# EAGLE design main_schematic (EAGLE 5.11)
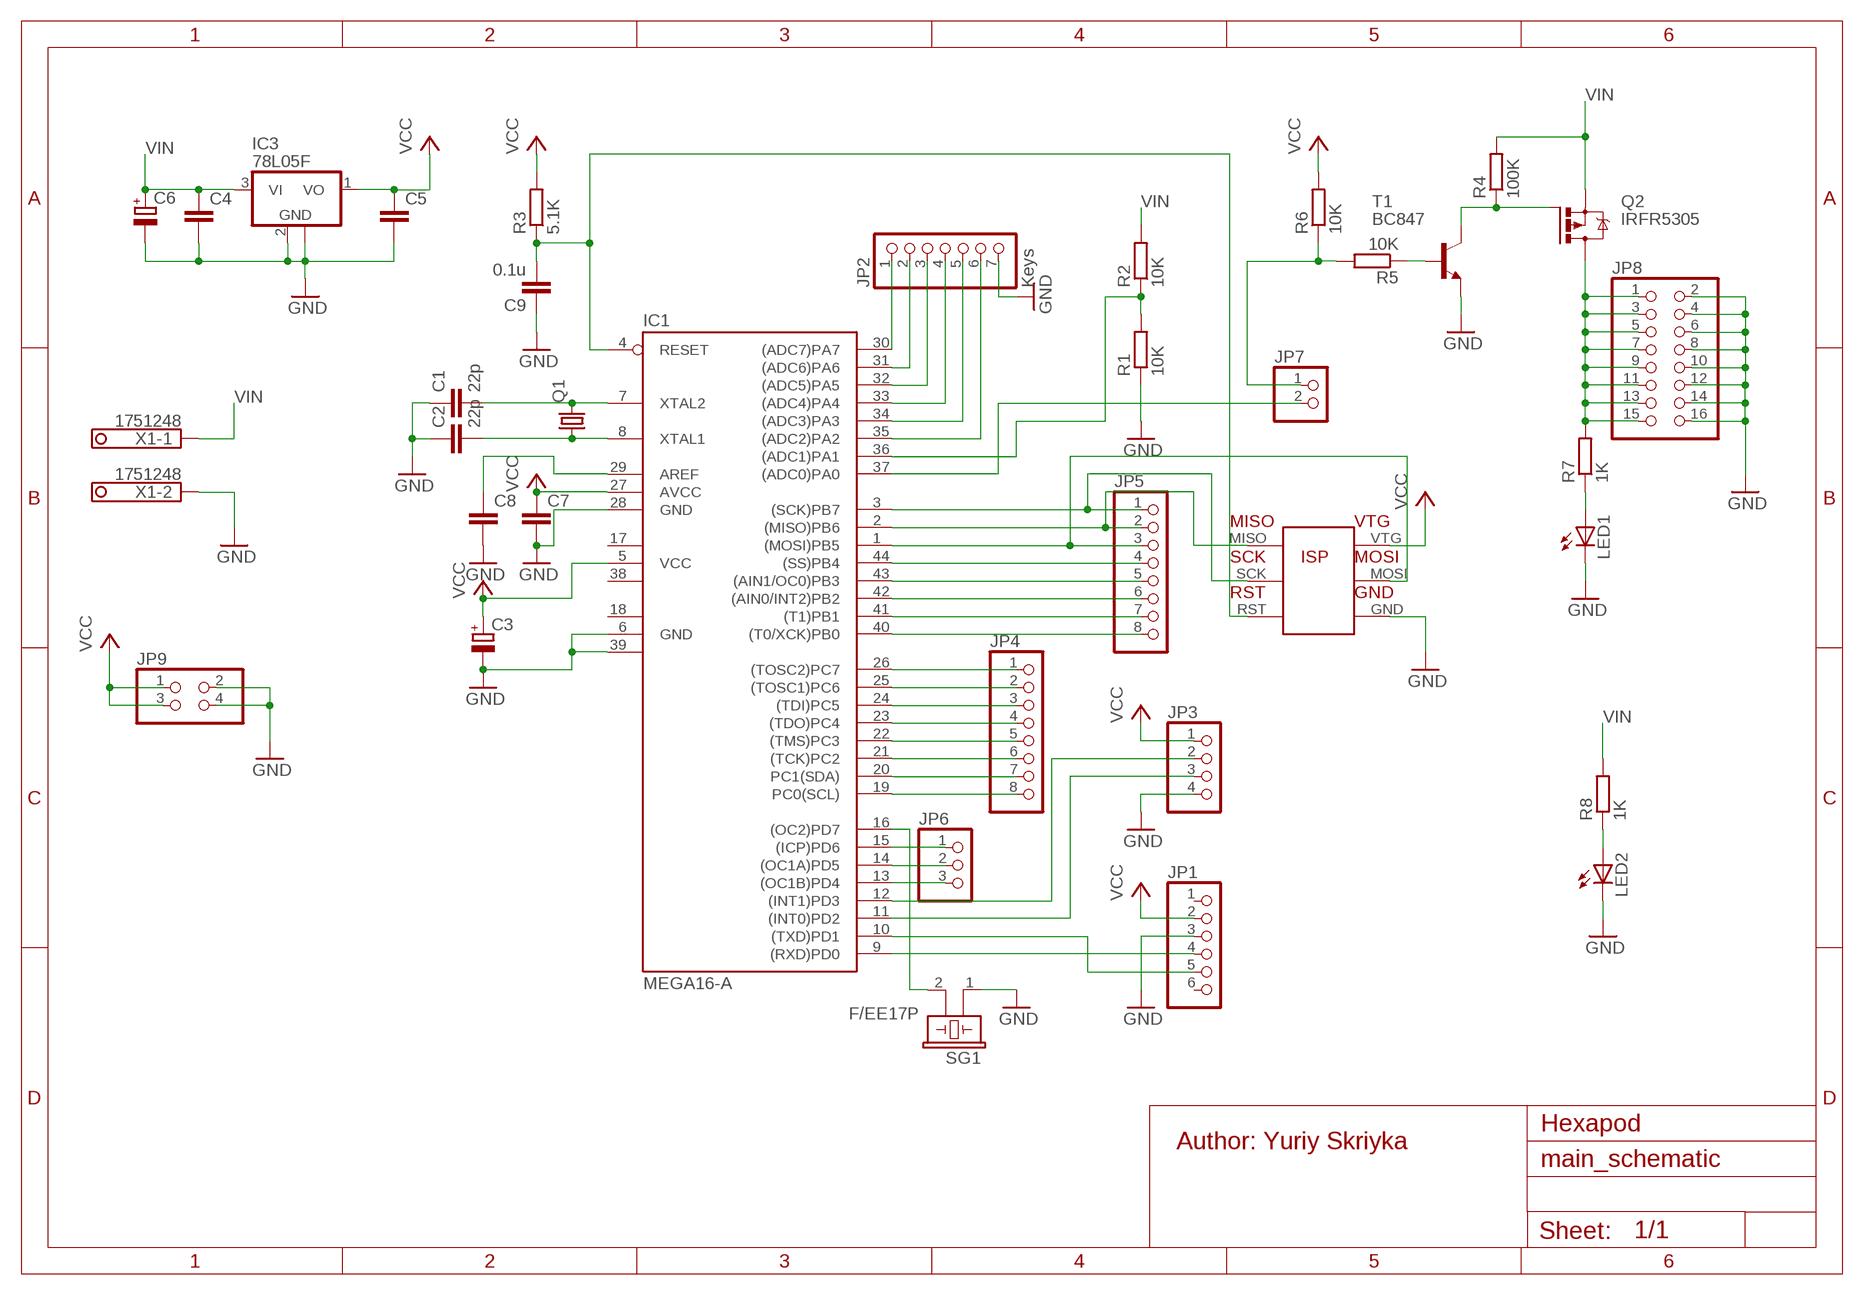
[diagram p0: schematic, sheet 1]

## Parts
C1  22p  C-EUC0805K  [C0805K]
C2  22p  C-EUC0805K  [C0805K]
C3  CPOL-EUE2,5-6E  [E2,5-6E]
C4  C-EUC0805K  [C0805K]
C5  C-EUC0805K  [C0805K]
C6  CPOL-EUE2,5-6E  [E2,5-6E]
C7  C-EUC0805K  [C0805K]
C8  C-EUC0805K  [C0805K]
C9  0.1u  C-EUC0805K  [C0805K]
IC1  MEGA16-A  [TQFP44]
IC3  78L05F  [SOT89]
JP1  PINHD-1X6  [1X06]
JP2  Keys  PINHD-1X7  [1X07]
JP3  PINHD-1X4  [1X04]
JP4  PINHD-1X8  [1X08]
JP5  PINHD-1X8  [1X08]
JP6  PINHD-1X3  [1X03]
JP7  PINHD-1X2  [1X02]
JP8  PINHD-2X8  [2X08]
JP9  PINHD-2X2  [2X02]
LED1  LEDSMT1206  [1206]
LED2  LEDSMT1206  [1206]
Q1  CRYSTALHC49S  [HC49/S]
Q2  IRFR5305  [D-PAK_TO252AA]
R1  10K  R-EU_R0805W  [R0805W]
R2  10K  R-EU_R0805W  [R0805W]
R3  5.1K  R-EU_M0805  [M0805]
R4  100K  R-EU_R0805W  [R0805W]
R5  10K  R-EU_R0805W  [R0805W]
R6  10K  R-EU_R0805W  [R0805W]
R7  1K  R-EU_R0805W  [R0805W]
R8  1K  R-EU_R0805W  [R0805W]
SG1  F/EE17P  [F/EE17P]
T1  BC847  [SOT23]
U$1  AVR_ISP6PIN  [ISP6PIN]
X1  1751248  [1751248]

## Nets
GND: C1.1 C2.1 C3.- C4.2 C5.2 C6.- C7.2 C8.2 C9.1 IC1.6(GND) IC1.28(GND) IC1.39(GND2) IC3.2(GND) IC3.2@1(GND) JP1.3 JP2.7 JP3.4 JP8.2 JP8.4 JP8.6 JP8.8 JP8.10 JP8.12 JP8.14 JP8.16 JP9.2 JP9.4 LED1.C LED2.C R1.1 SG1.1 T1.2(E) U$1.GND X1.2
N$1: C1.2 IC1.7(XTAL2) Q1.2
N$2: C2.2 IC1.8(XTAL1) Q1.1
N$3: IC1.30((ADC7)PA7) JP2.1
N$4: IC1.9((RXD)PD0) JP1.4
N$5: IC1.10((TXD)PD1) JP1.5
N$6: IC1.36((ADC1)PA1) R1.2 R2.1
N$7: IC1.31((ADC6)PA6) JP2.2
N$8: IC1.32((ADC5)PA5) JP2.3
N$9: IC1.33((ADC4)PA4) JP2.4
N$10: IC1.34((ADC3)PA3) JP2.5
N$11: IC1.35((ADC2)PA2) JP2.6
N$12: C8.1 IC1.29(AREF)
N$13: IC1.13((OC1B)PD4) JP6.3
N$14: IC1.11((INT0)PD2) JP3.3
N$15: IC1.12((INT1)PD3) JP3.2
N$16: IC1.3((SCK)PB7) JP5.1 U$1.SCK
N$17: IC1.2((MISO)PB6) JP5.2 U$1.MISO
N$18: IC1.1((MOSI)PB5) JP5.3 U$1.MOSI
N$19: IC1.44((SS)PB4) JP5.4
N$20: IC1.43((AIN1/OC0)PB3) JP5.5
N$21: IC1.42((AIN0/INT2)PB2) JP5.6
N$22: IC1.41((T1)PB1) JP5.7
N$23: IC1.40((T0/XCK)PB0) JP5.8
N$24: IC1.26((TOSC2)PC7) JP4.1
N$25: IC1.25((TOSC1)PC6) JP4.2
N$26: IC1.24((TDI)PC5) JP4.3
N$27: IC1.23((TDO)PC4) JP4.4
N$28: IC1.22((TMS)PC3) JP4.5
N$29: IC1.21((TCK)PC2) JP4.6
N$30: IC1.20(PC1(SDA)) JP4.7
N$31: IC1.19(PC0(SCL)) JP4.8
N$32: IC1.14((OC1A)PD5) JP6.2
N$33: IC1.15((ICP)PD6) JP6.1
N$34: IC1.16((OC2)PD7) SG1.2
N$35: IC1.37((ADC0)PA0) JP7.2
N$36: Q2.1(G) R4.1 T1.3(C)
N$37: JP7.1 R5.2 R6.1
N$38: C9.2 IC1.4(RESET) R3.1 U$1.RST
N$39: R5.1 T1.1(B)
N$40: LED1.A R7.1
N$41: LED2.A R8.1
NET23: JP8.1 JP8.3 JP8.5 JP8.7 JP8.9 JP8.11 JP8.13 JP8.15 Q2.4(D) R7.2
VCC: C3.+ C5.1 C7.1 IC1.5(VCC) IC1.27(AVCC) IC3.1(VO) JP1.2 JP3.1 JP9.1 JP9.3 R3.2 R6.2 U$1.VTG
VIN: C4.1 C6.+ IC3.3(VI) Q2.3(S) R2.2 R4.2 R8.2 X1.1
Unconnected: JP1.1 JP1.6

## Notes on the sheet
- Hexapod
- Author: Yuriy Skriyka

## Power pins joined to a net without a drawn wire
GND1: IC1.18(GND1)
VCC1: IC1.17(VCC1)
VCC2: IC1.38(VCC2)

## Library data of the parts
C1 C2 C4 C5 C7-C9 = rcl:C-EU: CAPACITOR, European symbol
C3 C6 = resistor:CPOL-EU: POLARIZED CAPACITOR, European symbol
IC1 = atmel:MEGA16: MICROCONTROLLER 16 Kbytes FLASH 1 kbytes SRAM 512 bytes EEPROM USART 8-channel 10 bit ADC Source: avr.lbr; MPN: ATMEGA16-16AU; OC_FARNELL: 9171134; OC_NEWARK: 96K6515
IC3 = linear:78L*: POSITOIV-VOLTAGE REGULATORS Output up to 100 mA Source: http://focus.ti.com/lit/ds/symlink/ua78l05.pdf
JP1 = pinhead:PINHD-1X6: PIN HEADER
JP2 = pinhead:PINHD-1X7: PIN HEADER
JP3 = pinhead:PINHD-1X4: PIN HEADER
JP4 JP5 = pinhead:PINHD-1X8: PIN HEADER
JP6 = pinhead:PINHD-1X3: PIN HEADER
JP7 = pinhead:PINHD-1X2: PIN HEADER
JP8 = pinhead:PINHD-2X8: PIN HEADER
JP9 = pinhead:PINHD-2X2: PIN HEADER
LED1 LED2 = led:LED: LED OSRAM: - CHIPLED LG R971, LG N971, LY N971, LG Q971, LY Q971, LO R971, LY R971 LH N974, LH R974 LS Q976, LO Q976, LY Q976 LO Q996 - Hyper CHIPLED LW Q18S LB Q993, LB Q99A, LB R99A - SideLED LS A670, LO A670, LY A670, LG A670, LP A670 LB A673, LV A673, LT A673, LW A673 LH A674 LY A675 LS A676, LA A676, LO A676, LY A676, LW A676 LS A679, LY A679, LG A679 - Hyper Micro SIDELED® LS Y876, LA Y876, LO Y876, LY Y876 LT Y87S - SmartLED LW L88C, LW L88S LB L89C, LB L89S, LG L890 LS L89K, LO L89K, LY L89K LS L896, LA L896, LO L896, LY L896 - TOPLED LS T670, LO T670, LY T670, LG T670, LP T670 LSG T670, LSP T670, LSY T670, LOP T670, LYG T670 LG T671, LOG T671, LSG T671 LB T673, LV T673, LT T673, LW T673 LH T674 LS T676, LA T676, LO T676, LY T676, LB T676, LH T676, LSB T676, LW T676 LB T67C, LV T67C, LT T67C, LS T67K, LO T67K, LY T67K, LW E67C LS E67B, LA E67B, LO E67B, LY E67B, LB E67C, LV E67C, LT E67C LW T67C LS T679, LY T679, LG T679 LS T770, LO T770, LY T770, LG T770, LP T770 LB T773, LV T773, LT T773, LW T773 LH T774 LS E675, LA E675, LY E675, LS T675 LS T776, LA T776, LO T776, LY T776, LB T776 LHGB T686 LT T68C, LB T68C - Hyper Mini TOPLED® LB M676 - Mini TOPLED Santana® LG M470 LS M47K, LO M47K, LY M47K Source: http://www.osram.convergy.de LUXEON: - LUMILED® LXK2-PW12-R00, LXK2-PW12-S00, LXK2-PW14-U00, LXK2-PW14-V00 LXK2-PM12-R00, LXK2-PM12-S00, LXK2-PM14-U00 LXK2-PE12-Q00, LXK2-PE12-R00, LXK2-PE12-S00, LXK2-PE14-T00, LXK2-PE14-U00 LXK2-PB12-K00, LXK2-PB12-L00, LXK2-PB12-M00, LXK2-PB14-N00, LXK2-PB14-P00, LXK2-PB14-Q00 LXK2-PR12-L00, LXK2-PR12-M00, LXK2-PR14-Q00, LXK2-PR14-R00 LXK2-PD12-Q00, LXK2-PD12-R00, LXK2-PD12-S00 LXK2-PH12-R00, LXK2-PH12-S00 LXK2-PL12-P00, LXK2-PL12-Q00, LXK2-PL12-R00 Source: www.luxeon.com KINGBRIGHT: KA-3528ASYC Source: www.kingbright.com
Q1 = crystal:CRYSTAL: CRYSTAL; OC_FARNELL: 1667008; OC_NEWARK: unknown
Q2 = transistor-power:IRF?5305: HEXFET Power MOSFET Source: http://www.irf.com/product-info/datasheets/data/irfr5305pbf.pdf
R1-R8 = rcl:R-EU_: RESISTOR, European symbol
SG1 = buzzer:F/EE17P: BUZZER Source: Buerklin; OC_FARNELL: unknown; OC_NEWARK: unknown
T1 = transistor:BC847: NPN TRANSISTOR
U$1 = MyOwn:AVR_ISP6PIN: Programming interface ISP
X1 = con-phoenix-350:1751248: MKDS 1/ 2-3,5 Printklemme Nennstrom: 10 A Bemessungsspannung: 160 V Raster: 3,5 mm Polzahl: 2 Montageart: Löten Anschlussart: Schraubanschluss Anschlussrichtung vom Leiter zur Platine: 0° Source: http://eshop.phoenixcontact.com .. 1751248.pdf; OC_FARNELL: unknown; OC_NEWARK: unknown

## Board
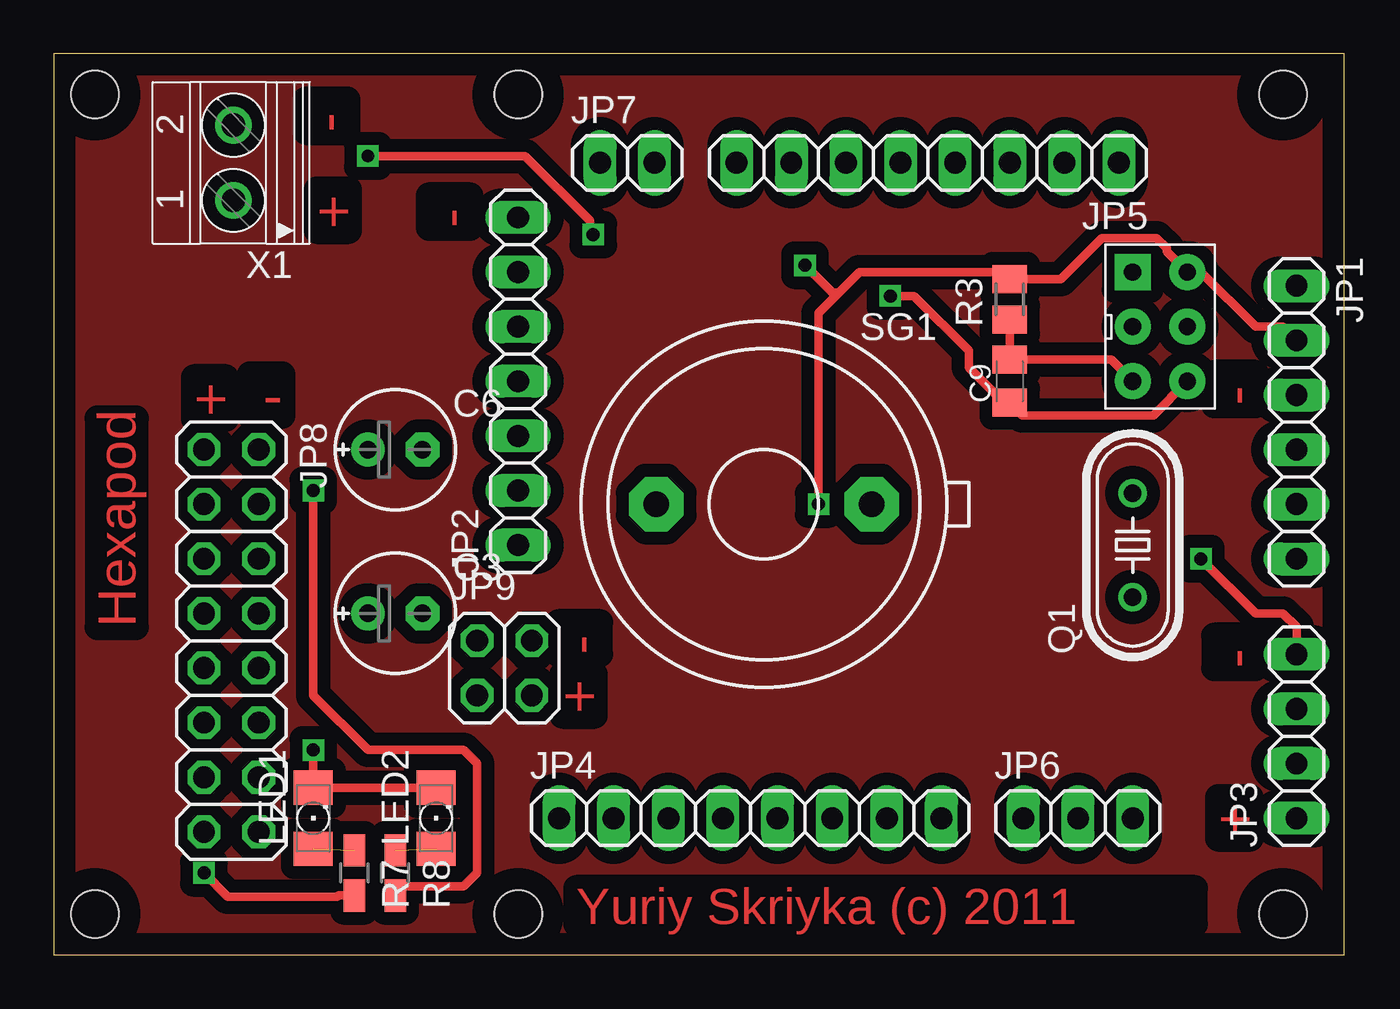
[diagram p1: board, top side]
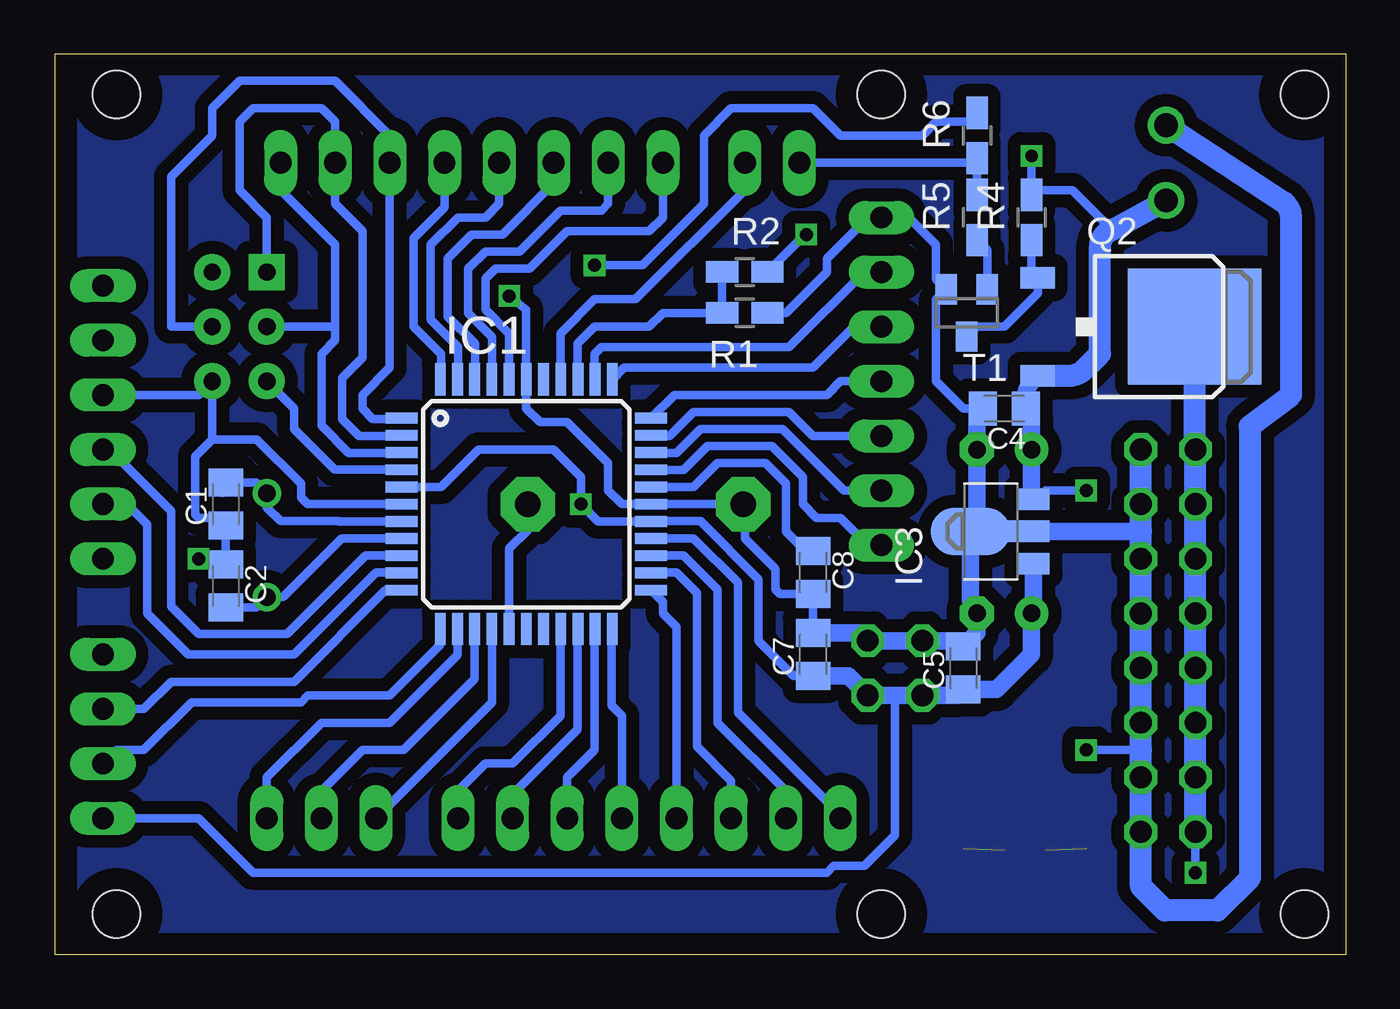
[diagram p2: board, bottom side, seen from below]

Size 59.99 x 41.9 mm. Coordinates in mm from the lower left corner, seen from the top.
Outline: 0,0 59.99,0 59.99,41.9 0,41.9 0,0
Copper layers (1*16): Top 0.035mm / dielectric 1.5mm / Bottom 0.035mm
Design rules "default *": minimum track width 10mil, minimum drill 24mil, track to track 0.6mm, track to pad 0.5mm, pad to pad 8mil, via to via 8mil, smd to smd 8mil, copper to edge 40mil, drill to drill 8mil, minimum pad ring 10mil, minimum via ring 8mil, stop-mask expansion 4mil, vias tented up to drill 0mil, thermal gap 10mil
Holes 2.2 mm at 57.15,40.01 57.15,1.91 21.59,1.91 21.59,40.01 1.91,1.91 1.91,40.01

### Footprints (pad centres in the part's own frame; a part is rotated, then mirrored left to right if it is on the bottom)
C0805K = smd 1.3 x 1.6: 1 -1,0; 2 1,0
E2,5-6E = drill 0.813 pad 1.575 round: + -1.27,0 | drill 0.813 pad 1.575 octagon: - 1.27,0
TQFP44 = smd 1.5 x 0.5: 1 -5.8,4; 2 -5.8,3.2; 3 -5.8,2.4; 4 -5.8,1.6; 5 -5.8,0.8; 6 -5.8,0; 7 -5.8,-0.8; 8 -5.8,-1.6; 9 -5.8,-2.4; 10 -5.8,-3.2; 11 -5.8,-4; 23 5.8,-4; 24 5.8,-3.2; 25 5.8,-2.4; 26 5.8,-1.6; 27 5.8,-0.8; 28 5.8,0; 29 5.8,0.8; 30 5.8,1.6; 31 5.8,2.4; 32 5.8,3.2; 33 5.8,4 | smd 0.5 x 1.5: 12 -4,-5.8; 13 -3.2,-5.8; 14 -2.4,-5.8; 15 -1.6,-5.8; 16 -0.8,-5.8; 17 0,-5.8; 18 0.8,-5.8; 19 1.6,-5.8; 20 2.4,-5.8; 21 3.2,-5.8; 22 4,-5.8; 34 4,5.8; 35 3.2,5.8; 36 2.4,5.8; 37 1.6,5.8; 38 0.8,5.8; 39 0,5.8; 40 -0.8,5.8; 41 -1.6,5.8; 42 -2.4,5.8; 43 -3.2,5.8; 44 -4,5.8
SOT89 = smd 1 x 1.5: 1 -1.499,-1.981; 3 1.499,-1.981 | smd 1 x 2: 2 0,-1.727 | smd 2.2 x 3.7: 2@1 0,0.94
1X06 = drill 1.016 long: 1 -6.35,0; 2 -3.81,0; 3 -1.27,0; 4 1.27,0; 5 3.81,0; 6 6.35,0
1X07 = drill 1.016 long: 1 -7.62,0; 2 -5.08,0; 3 -2.54,0; 4 0,0; 5 2.54,0; 6 5.08,0; 7 7.62,0
1X04 = drill 1.016 long: 1 -3.81,0; 2 -1.27,0; 3 1.27,0; 4 3.81,0
1X08 = drill 1.016 long: 1 -8.89,0; 2 -6.35,0; 3 -3.81,0; 4 -1.27,0; 5 1.27,0; 6 3.81,0; 7 6.35,0; 8 8.89,0
1X03 = drill 1.016 long: 1 -2.54,0; 2 0,0; 3 2.54,0
1X02 = drill 1.016 long: 1 -1.27,0; 2 1.27,0
2X08 = drill 1.016 octagon: 1 -8.89,-1.27; 2 -8.89,1.27; 3 -6.35,-1.27; 4 -6.35,1.27; 5 -3.81,-1.27; 6 -3.81,1.27; 7 -1.27,-1.27; 8 -1.27,1.27; 9 1.27,-1.27; 10 1.27,1.27; 11 3.81,-1.27; 12 3.81,1.27; 13 6.35,-1.27; 14 6.35,1.27; 15 8.89,-1.27; 16 8.89,1.27
2X02 = drill 1.016 octagon: 1 -1.27,-1.27; 2 -1.27,1.27; 3 1.27,-1.27; 4 1.27,1.27
1206 = smd 1.6 x 1.803: A -1.422,0; C 1.422,0
HC49/S = drill 0.813 round: 1 -2.413,0; 2 2.413,0
D-PAK_TO252AA = smd 1 x 1.6: 1 -2.28,-4.8; 3 2.28,-4.8 | smd 5.4 x 6.2: 4 0,2.5
R0805W = smd 1.5 x 1: 1 -1.052,0; 2 1.052,0
M0805 = smd 1.3 x 1.6: 1 -0.95,0; 2 0.95,0
F/EE17P = drill 1.194 pad 2.54 octagon: 1 -5.004,0; 2 5.004,0
SOT23 = smd 1 x 1.4: 1 -0.95,-1.1; 2 0.95,-1.1; 3 0,1.1
ISP6PIN = drill 0.8 pad 1.676 round: GND 2.54,-5.08; MOSI 2.54,-2.54; RST 0,-5.08; SCK 0,-2.54; VTG 2.54,0 | drill 0.8 pad 1.676 square: MISO 0,0
1751248 = drill 1.1 pad 1.7 round: 1 -1.75,-0.1; 2 1.75,-0.1

### Placement (x,y rotation side)
C1  52.07,20.95 90 bottom
C2  52.07,17.14 270 bottom
C3  15.88,15.88 0 top
C4  15.88,25.4 180 bottom
C5  17.78,13.34 90 bottom
C6  15.88,23.5 0 top
C7  24.77,13.97 90 bottom
C8  24.77,17.78 270 bottom
C9  44.45,26.67 90 top
IC1  38.1,20.95 0 bottom
IC3  16.51,19.68 90 bottom
JP1  57.78,24.77 270 top
JP2  21.59,26.67 90 top
JP3  57.78,10.16 90 top
JP4  32.38,6.35 0 top
JP5  40.64,36.83 180 top
JP6  47.62,6.35 0 top
JP7  26.67,36.83 0 top
JP8  8.26,14.61 270 top
JP9  20.95,13.34 0 top
LED1  12.06,6.35 90 top
LED2  17.78,6.35 90 top
Q1  50.16,19.05 90 top
Q2  9.53,29.21 270 bottom
R1  27.94,29.84 180 bottom
R2  27.94,31.75 0 bottom
R3  44.45,30.48 90 top
R4  14.61,34.29 90 bottom
R5  17.14,34.29 90 bottom
R6  17.14,38.1 90 bottom
R7  13.97,3.81 270 top
R8  15.88,3.81 270 top
SG1  33.02,20.95 0 top
T1  17.62,29.84 180 bottom
U$1  50.16,31.75 0 top
X1  8.26,36.83 90 top

### Tracks (layer width: path | path; a pad name or v marks a point on that pad's centre or on a via)
GND  (via drill 0.6)
  Top 0.406: U$1.GND 51.12,25.08 45.04,25.08 C9.1 44.18,25.67 42.55,27.3 42.55,28.1 40.01,30.64 v38.89,30.64 | v53.34,18.41 55.88,15.88 57.15,15.88 57.78,15.24 JP3.4 | v38.89,30.64 | LED2.C LED1.C v12.06,9.53
  Bottom 0.406: 52.7,23.97 53.5,23.18 53.5,20.48 53.34,20.32 52.44,20.32 C1.1 C2.1 52.34,18.41 v53.34,18.41 | 52.7,23.97 U$1.GND 53.34,26.04 JP1.3 | IC1.6 48.26,20.95 48.58,21.27 48.58,21.91 50.64,23.97 52.7,23.97 | C7.2 C8.2 26.3,16.78 26.51,16.99 26.51,17.94 27.94,19.37 27.94,20.88 SG1.1 IC1.28 33.66,20.95 34.29,21.59 34.29,22.86 36.2,24.77 37.47,24.77 38.1,25.4 IC1.39 38.1,30 v38.89,30.64 | R1.1 26.04,29.84 24.13,31.75 24.13,32.38 22.23,34.29 JP2.7 20.32,34.29 19.05,33.02 19.05,31.42 T1.2 19.05,30.47 19.05,26.67 17.78,25.4 C4.2 17.14,25.13 | IC3.2 IC3.2@1 | 9.53,9.53 v12.06,9.53
  Bottom 0.813: 9.53,19.68 IC3.2 | 17.14,25.13 C6.- 17.14,20.4 arc45 17.44,19.7 IC3.2@1 17.45,16.59 arc-45 17.16,15.89 C3.- 17.14,14.97 C5.2 18.05,14.61 JP9.2 JP9.4 22.59,14.97 C7.2
  Bottom 1.016: JP8.2 JP8.4 9.53,19.68 JP8.6 JP8.8 JP8.10 JP8.12 9.53,9.53 JP8.14 JP8.16 9.53,3.17 8.41,2.06 5.97,2.06 4.45,3.59 4.45,24.56 4.47,24.58 2.54,26.04 2.54,34.26 arc-45 2.83,34.96 X1.2
N$1
  Bottom 0.406: IC1.7 46.83,20.16 49.53,20.16 50.16,20.8 Q1.2 | Q1.2 50.04,21.59 | 52.21,21.46 C1.2 50.66,21.95 Q1.2
N$2
  Bottom 0.406: IC1.8 46.69,19.36 49.4,16.64 Q1.1 50.66,16.14 C2.2
N$3
  Bottom 0.406: IC1.30 32.29,22.54 30.8,22.54 29.69,23.65 26.67,23.65 25.24,22.23 25.24,20.95 24.61,20.32 23.5,20.32 22.23,19.05 JP2.1
N$4
  Bottom 0.406: IC1.9 43.92,18.57 45.56,18.57 49.21,14.92 53.34,14.92 54.61,16.19 54.61,20.64 57.47,23.5 JP1.4
N$5
  Bottom 0.406: IC1.10 43.92,17.78 45.09,17.78 48.9,13.97 53.82,13.97 55.72,15.88 55.72,20 56.67,20.95 JP1.5
N$6
  Bottom 0.406: IC1.36 35.72,26.77 35.72,28.42 34.92,29.21 32.38,29.21 31.75,29.84 R1.2 R2.1
N$7
  Bottom 0.406: IC1.31 32.28,23.34 31.11,23.34 30,24.45 26.19,24.45 23.34,21.59 JP2.2
N$8
  Bottom 0.406: IC1.32 32.27,24.13 31.43,24.13 30.32,25.24 25.88,25.24 24.77,24.13 JP2.3
N$9
  Bottom 0.406: IC1.33 31.22,26.04 24.13,26.04 23.5,26.67 JP2.4
N$10
  Bottom 0.406: IC1.34 33.55,27.3 24.77,27.3 22.86,29.21 JP2.5
N$11
  Bottom 0.406: IC1.35 34.92,26.78 34.92,27.94 34.61,28.26 25.88,28.26 22.38,31.75 JP2.6
N$12
  Bottom 0.406: IC1.29 30.32,21.75 29.21,22.86 26.99,22.86 26.04,21.91 26.04,19.68 25.13,18.78 C8.1
N$13
  Bottom 0.406: JP6.3 50.16,8.26 47.62,10.79 44.45,10.79 41.3,13.95 IC1.13
N$14
  Bottom 0.406: JP3.3 55.88,11.43 54.61,12.7 48.9,12.7 44.64,16.95 IC1.11
N$15
  Bottom 0.406: JP3.2 57.15,9.53 55.88,9.53 53.66,11.75 48.58,11.75 48.26,12.06 44.45,12.06 42.1,14.41 IC1.12
N$16
  Bottom 0.406: IC1.3 43.92,23.34 46.35,23.34 47.62,24.61 47.62,27.94 46.99,28.57 46.99,29.21 | 46.99,29.21 46.99,33.02 49.53,35.56 JP5.1 | 46.99,29.21 U$1.SCK
N$17
  Bottom 0.406: IC1.2 43.92,24.13 45.88,24.13 46.67,24.92 46.67,26.83 45.72,27.78 45.72,33.66 46.99,34.92 JP5.2 46.99,38.73 47.62,39.37 50.8,39.37 51.44,38.73 51.44,35.56 50.16,34.29 U$1.MISO
N$18
  Bottom 0.406: IC1.1 43.93,24.92 45.24,24.92 45.72,25.4 45.72,26.04 44.45,27.3 JP5.3 44.45,38.1 46.99,40.64 51.44,40.64 52.7,39.37 52.7,38.1 54.61,36.2 54.61,29.21 U$1.MOSI
N$19
  Bottom 0.406: IC1.44 42.07,26.79 42.07,27.94 43.34,29.21 43.34,33.34 41.91,34.77 JP5.4
N$20
  Bottom 0.406: IC1.43 41.27,26.78 41.27,28.26 42.55,29.53 42.55,33.02 41.27,34.29 40.01,34.29 39.37,34.92 JP5.5
N$21
  Bottom 0.406: IC1.42 40.48,26.77 40.48,28.42 41.75,29.69 41.75,32.38 40.64,33.5 39.21,33.5 36.83,35.88 JP5.6
N$22
  Bottom 0.406: IC1.41 39.69,26.77 39.69,28.73 40.8,29.84 40.8,31.91 40.01,32.7 38.42,32.7 36.51,34.61 34.61,34.61 34.29,34.92 JP5.7
N$23
  Bottom 0.406: JP5.8 31.75,34.29 32.38,33.66 36.2,33.66 37.94,31.91 39.53,31.91 40.01,31.43 40.01,30 38.89,28.89 IC1.40
N$24
  Bottom 0.406: IC1.26 32.29,19.37 30.32,19.37 28.26,17.3 28.26,11.27 23.5,6.51 JP4.1
N$25
  Bottom 0.406: IC1.25 32.28,18.57 30.8,18.57 29.21,16.99 29.21,10.79 26.04,7.62 JP4.2
N$26
  Bottom 0.406: IC1.24 32.27,17.78 31.11,17.78 30.16,16.83 30.16,9.68 28.57,8.1 JP4.3
N$27
  Bottom 0.406: IC1.23 31.75,16.41 31.75,15.88 31.11,15.24 JP4.4
N$28
  Bottom 0.406: IC1.22 34.13,15.12 34.13,11.59 33.66,11.11 JP4.5
N$29
  Bottom 0.406: IC1.21 34.92,15.13 34.92,9.53 36.2,8.26 JP4.6
N$30
  Bottom 0.406: IC1.20 35.72,15.14 35.72,10.48 38.73,7.46 JP4.7
N$31
  Bottom 0.406: IC1.19 36.51,15.14 36.51,11.11 38.73,8.89 40.01,8.89 41.27,7.62 JP4.8
N$32
  Bottom 0.406: JP6.2 47.62,7.62 45.72,9.53 43.81,9.53 40.5,12.84 IC1.14
N$33
  Bottom 0.406: JP6.1 39.69,11.75 39.69,12.22 39.7,12.24 IC1.15
N$34
  Bottom 0.406: IC1.16 38.89,18.89 38.02,19.76 SG1.2
N$35
  Bottom 0.406: IC1.37 36.51,26.77 36.51,28.89 34.92,30.48 33.02,30.48 27.94,35.56 JP7.2
N$36
  Bottom 0.406: T1.3 17.16,29.21 15.88,29.21 14.32,30.76 Q2.1 14.61,31.77 R4.1
N$37
  Bottom 0.406: R5.2 R6.1 17.36,36.83 JP7.1
N$38
  Top 0.406: U$1.RST 49.16,27.67 C9.2 R3.1
  Bottom 0.406: U$1.RST 48.9,25.4 48.9,24.45 47,22.55 IC1.4
N$39
  Bottom 0.406: R5.1 16.67,32.76 T1.1
N$40  (1 unrouted)
N$41  (1 unrouted)
N$42
  pour Bottom: 0,0 0,41.91 60.33,41.91 60.33,0
N$43
  pour Top: 0,41.91 60.33,41.91 60.33,0 0,0
NET23  (via drill 0.6)
  Top 0.406: v6.99,3.81 8.1,2.7 13.18,2.7 13.23,2.76 R7.2
  Bottom 0.406: v6.99,3.81 JP8.15
  Bottom 1.016: JP8.15 JP8.13 JP8.11 JP8.9 JP8.7 JP8.5 JP8.3 JP8.1 arc45 7.03,23.59 Q2.4
VCC  (via drill 0.6)
  Top 0.406: JP1.2 57.15,29.21 55.88,29.21 53.34,31.75 U$1.VTG 51.75,32.7 51.75,32.86 51.28,33.34 48.74,33.34 46.83,31.43 R3.2 44.13,31.75 37.47,31.75 36.51,30.8 | 36.51,30.8 35.56,29.84 v35.56,20.95 | v34.92,32.07 36.2,30.8 36.51,30.8
  Bottom 0.406: C7.1 25.67,12.97 27.3,14.61 27.3,17.46 30,20.16 32.29,20.16 IC1.27 34.76,20.16 v35.56,20.95 35.56,22.23 36.83,23.5 40.32,23.5 42.07,21.75 IC1.5 | JP3.1 53.34,6.35 50.8,3.81 24.13,3.81 23.81,4.13 22.38,4.13 20.95,5.56 20.95,12.06 | v34.92,32.07 32.7,32.07 29.84,34.92 29.84,38.1 28.57,39.37 24.77,39.37 23.5,38.1 19.68,38.1 19.05,38.73 17.56,38.73 R6.2
  Bottom 0.813: IC3.1 14.53,16.06 arc45 C3.+ 14.61,13.97 16.24,12.34 C5.1 18.05,12.06 JP9.1 20.95,12.06 JP9.3 23.13,12.97 C7.1
VIN  (via drill 0.6)
  Top 0.406: R8.2 16.29,3.17 19.05,3.17 19.68,3.81 19.68,8.89 19.05,9.53 14.61,9.53 12.06,12.06 v12.06,21.59 | v25.08,33.5 24.92,33.66 24.92,34.13 21.91,37.15 v14.61,37.15
  Bottom 0.406: 14.61,21.26 IC3.3 14.38,21.18 13.97,21.59 v12.06,21.59 | 10.84,33.73 10.87,33.73 12.7,35.56 14.39,35.56 R4.2 v14.61,37.15 | R2.2 25.14,33.5 v25.08,33.5
  Bottom 0.813: Q2.3 14.58,26.67 arc-45 14.88,25.97 C4.1 arc45 14.61,24.75 C6.+ 14.61,21.26
  Bottom 1.016: X1.1 10.84,33.73 11.14,33.57 arc-45 11.43,32.86 11.43,27.94 12.15,27.22 arc45 12.85,26.93 Q2.3

### Text on the board
Top: - | + | - | - | - | + | Hexapod | - | - | + | + | Yuriy Skriyka (c) 2011